# Altium schematic sheet NORA_Clock_V0.2.SchDoc
size A3; Value: 13nH
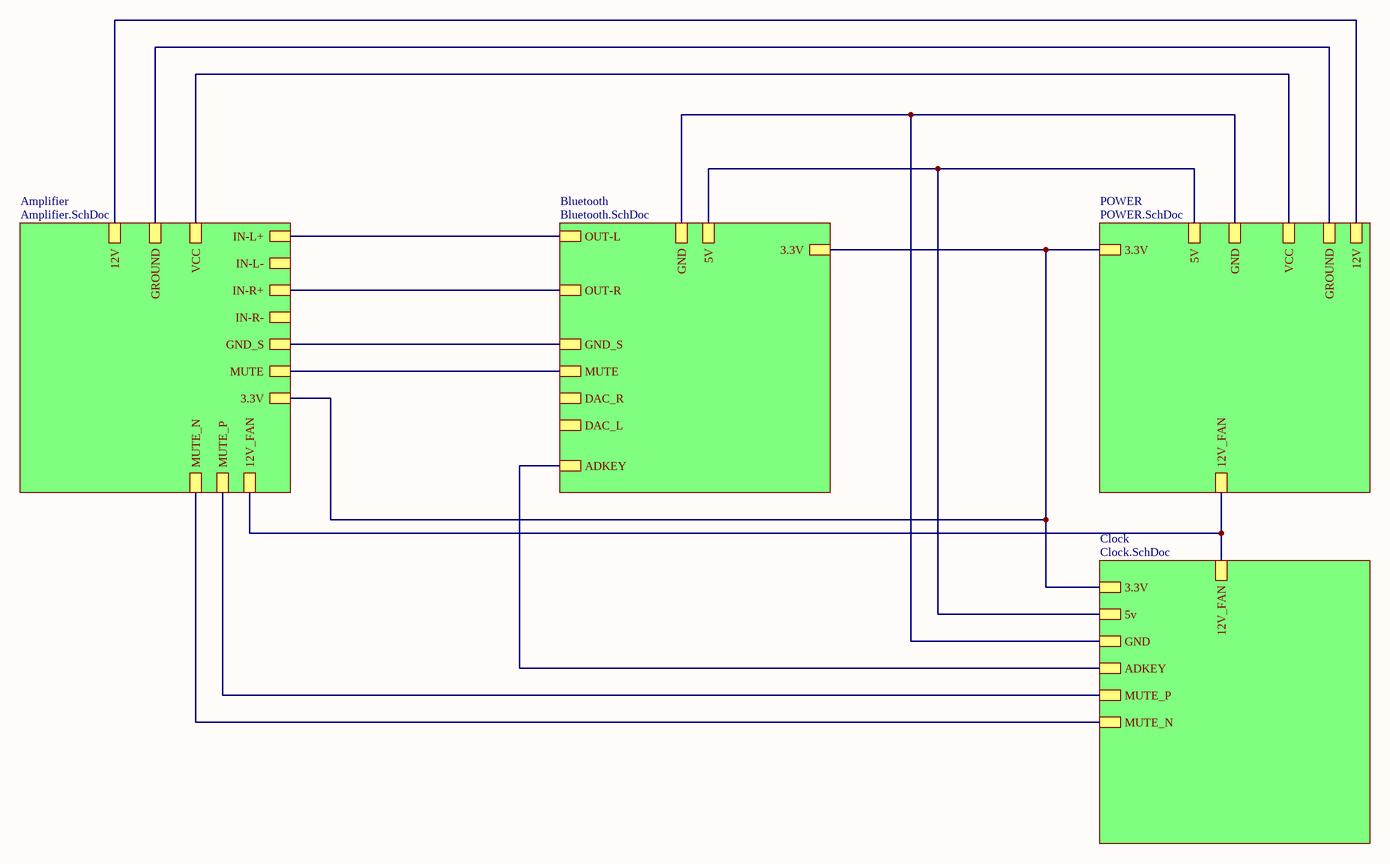
[diagram p0: NORA_Clock_V0.2.SchDoc]

## Sub-sheets
Amplifier = Amplifier.SchDoc: IN-L+, IN-L-, IN-R+, IN-R-, MUTE, VCC, GROUND, GND_S, 3.3V, 12V, MUTE_P, MUTE_N, 12V_FAN
Bluetooth = Bluetooth.SchDoc: OUT-L, OUT-R, 3.3V, GND_S, GND, 5V, MUTE, DAC_R, DAC_L, ADKEY
Clock = Clock.SchDoc: ADKEY, 3.3V, 5v, GND, MUTE_N, MUTE_P, 12V_FAN
POWER = POWER.SchDoc: 3.3V, GND, 5V, VCC, GROUND, 12V, 12V_FAN

## Nets
(unnamed): sheet Amplifier/IN-L+, sheet Bluetooth/OUT-L
(unnamed): sheet Amplifier/IN-R+, sheet Bluetooth/OUT-R
(unnamed): sheet Amplifier/MUTE, sheet Bluetooth/MUTE
(unnamed): sheet Amplifier/VCC, sheet POWER/VCC
(unnamed): sheet Amplifier/GROUND, sheet POWER/GROUND
(unnamed): sheet Amplifier/GND_S, sheet Bluetooth/GND_S
(unnamed): sheet Amplifier/3.3V, sheet Bluetooth/3.3V, sheet POWER/3.3V, sheet Clock/3.3V
(unnamed): sheet Amplifier/12V, sheet POWER/12V
(unnamed): sheet Amplifier/MUTE_P, sheet Clock/MUTE_P
(unnamed): sheet Amplifier/MUTE_N, sheet Clock/MUTE_N
(unnamed): sheet Amplifier/12V_FAN, sheet POWER/12V_FAN, sheet Clock/12V_FAN
(unnamed): sheet Bluetooth/GND, sheet POWER/GND, sheet Clock/GND
(unnamed): sheet Bluetooth/5V, sheet POWER/5V, sheet Clock/5v
(unnamed): sheet Bluetooth/ADKEY, sheet Clock/ADKEY

## Notes on the sheet
- Title
- Size:
- Date:
- A3
- Number:
- Time:
- Revision:
- Sheet
- of
- File: